# EAGLE design RGBdriver (EAGLE 7.2.0)
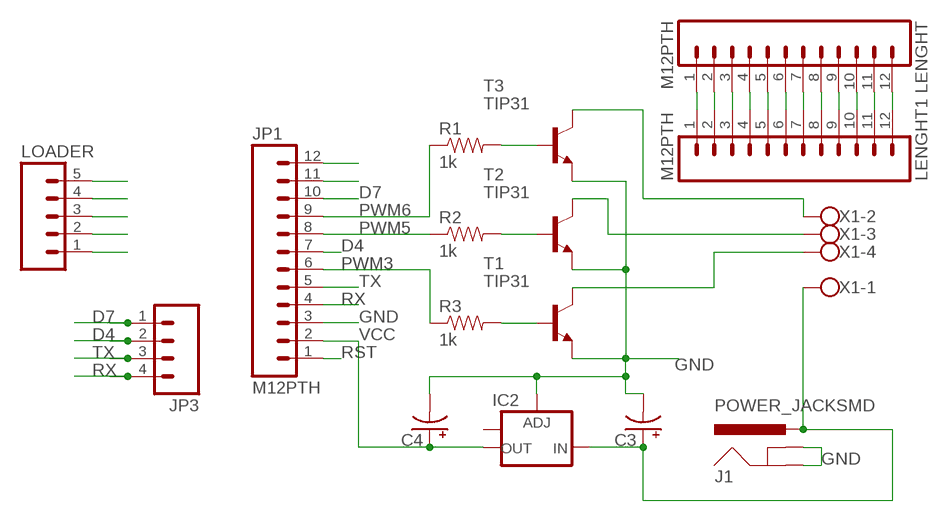
[diagram p0: schematic, sheet 1]

## Parts
C3  CAP_POLC  [PANASONIC_C]
C4  CAP_POLC  [PANASONIC_C]
IC2  V_REG_LM1117SOT223  [SOT223]
J1  POWER_JACKSMD  [POWER_JACK_SMD]
JP1  M12PTH  [1X12]
JP3  M04PTH  [1X04]
LENGHT  M12PTH  [1X12]
LENGHT1  M12PTH  [1X12]
LOADER  M05PTH  [1X05]
R1  1k  RESISTOR1206  [1206]
R2  1k  RESISTOR1206  [1206]
R3  1k  RESISTOR1206  [1206]
T1  TIP31  [TO220]
T2  TIP31  [TO220]
T3  TIP31  [TO220]
X1  W237-4  [W237-4]

## Nets
D4: JP1.7 JP3.2
D7: JP1.10 JP3.1
GND [power]: C3.- C4.- IC2.1(ADJ) J1.GND(GNDBREAK) J1.GNDBREAK(GND) JP1.3 JP1.11 JP1.12 LENGHT1.6 LENGHT1.12 LENGHT.6 LENGHT.12 LOADER.3 T1.3(E) T2.3(E) T3.3(E)
N$1: LENGHT1.1 LENGHT.1
N$2: R1.2 T3.1(B)
N$3: R3.2 T1.1(B)
N$4: T3.2(C) X1.2
N$5: T2.2(C) X1.3
N$6: LENGHT1.2 LENGHT.2
N$7: R2.2 T2.1(B)
N$8: T1.2(C) X1.4
N$9: C3.+ IC2.3(IN) J1.VIN0(PWR) X1.1
N$10: LENGHT1.3 LENGHT.3
N$11: LENGHT1.4 LENGHT.4
N$12: LENGHT1.5 LENGHT.5
N$14: LENGHT1.7 LENGHT.7
N$15: LENGHT1.8 LENGHT.8
N$16: LENGHT1.9 LENGHT.9
N$17: LENGHT1.10 LENGHT.10
N$18: LENGHT1.11 LENGHT.11
PWM3: JP1.6 R3.1
PWM5: JP1.8 R2.1
PWM6: JP1.9 R1.1
RST: JP1.1 LOADER.1
RX: JP1.4 JP3.4 LOADER.4
TX: JP1.5 JP3.3 LOADER.5
VCC [power]: C4.+ IC2.2(OUT) JP1.2 LOADER.2
Unconnected: IC2.4(OUT)

## Library data of the parts
C3 C4 = 01_SparkFun:CAP_POL: Capacitor Polarized These are standard SMD and PTH capacitors. Normally 10uF, 47uF, and 100uF in electrolytic and tantalum varieties. Always verify the external diameter of the through hole cap, it varies with capacity, voltage, and manufacturer. The EIA devices should be standard.
IC2 = 01_SparkFun:V_REG_LM1117: Voltage Regulator LM1117 Standard adjustable voltage regulator but in SMD form. Spark Fun Electronics SKU : COM-00595
J1 = 01_SparkFun:POWER_JACK: Power Jack This is the standard 5.5mm barrel jack for power. The PTH is the most common, proven, reliable, footprint. All others are experimental. The Slot footprint only works if the mill layer is transmitted to the PCB fab house so be warned. Spark Fun Electronics SKU : PRT-00119. Mating wall wart : TOL-00298 (and others)
JP1 LENGHT LENGHT1 = 01_SparkFun:M12: Header 12 Standard 12-pin 0.1" header. Use with straight break away headers (SKU : PRT-00116), right angle break away headers (PRT-00553), swiss pins (PRT-00743), machine pins (PRT-00117), and female headers (PRT-00115).
JP3 = 01_SparkFun:M04: Header 4 Standard 4-pin 0.1" header. Use with straight break away headers (SKU : PRT-00116), right angle break away headers (PRT-00553), swiss pins (PRT-00743), machine pins (PRT-00117), and female headers (PRT-00115). Molex polarized connector foot print use with SKU : PRT-08231 with associated crimp pins and housings.
LOADER = 01_SparkFun:M05: Header 5 Standard 5-pin 0.1" header. Use with straight break away headers (SKU : PRT-00116), right angle break away headers (PRT-00553), swiss pins (PRT-00743), machine pins (PRT-00117), and female headers (PRT-00115). Molex polarized connector foot print use with SKU : PRT-08230 with associated crimp pins and housings.
R1-R3 = 01_SparkFun:RESISTOR: Resistor Basic schematic elements and footprints for 0603, 1206, and PTH 1/10th watt (small) resistors.
T1-T3 = transistor:TIP31: NPN Transistor Medium Power Linear Switching Applications Source: http://onsemi.com
X1 = con-wago-500:W237-4: WAGO SCREW CLAMP; OC_FARNELL: unknown; OC_NEWARK: unknown

## Net classes
1 power: width 0.406 mm, clearance 1.016 mm
2 signal: width 0.203 mm, clearance 0.406 mm

## Board
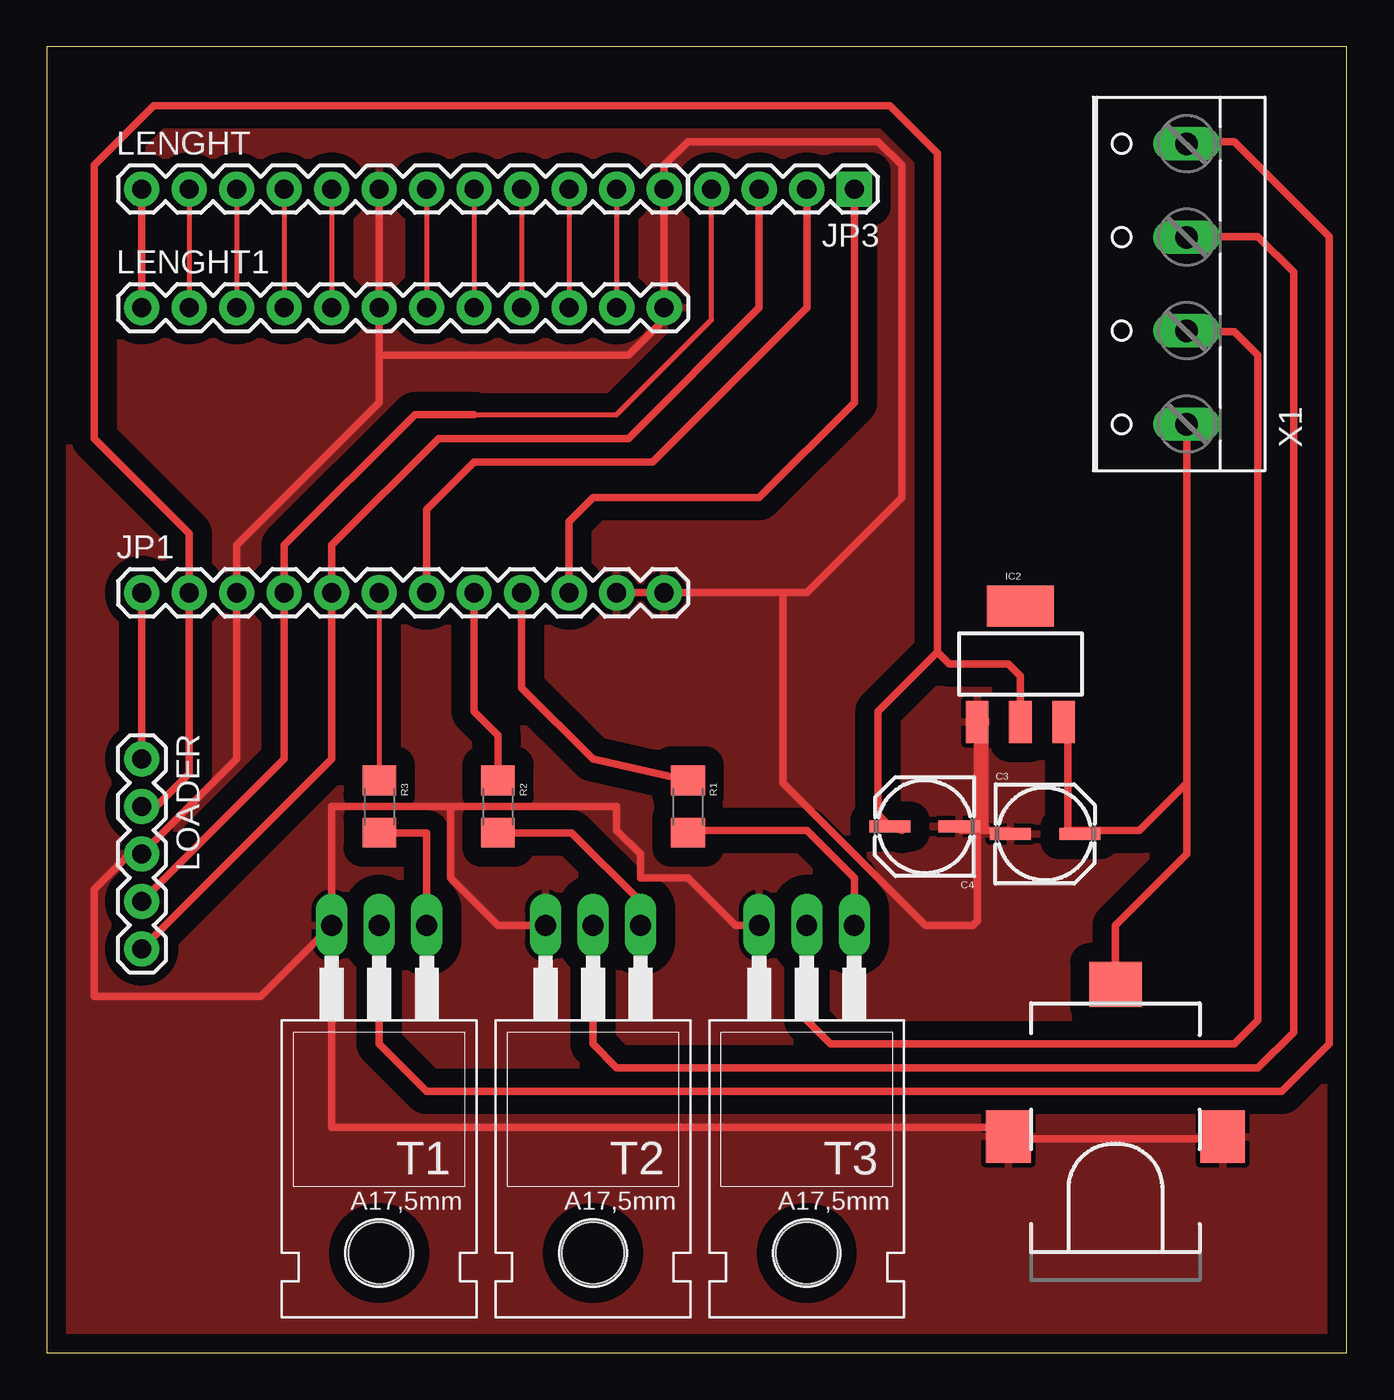
[diagram p1: board, top side]

Size 69.52 x 69.84 mm. Coordinates in mm from the lower left corner, seen from the top.
Outline: 0,0 69.52,0 69.52,69.84 0,69.84 0,0
Copper layers (1*16): Top 0.035mm / dielectric 1.5mm / Bottom 0.035mm
Design rules "default": minimum track width 10mil, minimum drill 24mil, track to track 8mil, track to pad 8mil, pad to pad 8mil, via to via 8mil, smd to smd 8mil, copper to edge 40mil, drill to drill 8mil, minimum pad ring 10mil, minimum via ring 8mil, stop-mask expansion 4mil, vias tented up to drill 0mil, thermal gap 10mil

### Footprints (pad centres in the part's own frame; a part is rotated, then mirrored left to right if it is on the bottom)
PANASONIC_C = smd 2.2 x 0.65: + 1.9,-0.2; - -1.8,-0.2
SOT223 = smd 1.219 x 2.235: 1 -2.311,-3.099; 2 0,-3.099; 3 2.311,-3.099 | smd 3.6 x 2.2: 4 0,3.099
POWER_JACK_SMD = smd 2.8 x 2.4: GND 2.667,-5.73; GNDBREAK 2.671,5.73 | smd 2.4 x 2.8: VIN0 10.81,0
1X12 = drill 1.016 pad 1.88: 1 0,0; 2 2.54,0; 3 5.08,0; 4 7.62,0; 5 10.16,0; 6 12.7,0; 7 15.24,0; 8 17.78,0; 9 20.32,0; 10 22.86,0; 11 25.4,0; 12 27.94,0
1X04 = drill 1.016 pad 1.88 square: 1 0,0 | drill 1.016 pad 1.88: 2 2.54,0; 3 5.08,0; 4 7.62,0
1X05 = drill 1.016 pad 1.88: 1 0,0; 2 2.54,0; 3 5.08,0; 4 7.62,0; 5 10.16,0
1206 = smd 1.6 x 1.8: 1 -1.4,0; 2 1.4,0
TO220 = drill 1.118 long: 1 -2.54,-6.35; 2 0,-6.35; 3 2.54,-6.35 | hole 3.302: 0,11.176
W237-4 = drill 1.194 long: 1 -7.5,-1.27; 2 -2.5,-1.27; 3 2.5,-1.27; 4 7.5,-1.27

### Placement (x,y rotation side)
C3  53.34,27.94 0 top
C4  46.99,27.94 180 top
IC2  52.07,36.83 0 top
J1  57.15,8.89 90 top
JP1  5.08,40.64 0 top
JP3  43.18,62.23 180 top
LENGHT  5.08,62.23 0 top
LENGHT1  5.08,55.88 0 top
LOADER  5.08,31.75 270 top
R1  34.29,29.21 270 top
R2  24.13,29.21 270 top
R3  17.78,29.21 270 top
T1  17.78,16.51 180 top
T2  29.21,16.51 180 top
T3  40.64,16.51 180 top
X1  59.69,57.15 90 top

### Tracks (layer width: path | path; a pad name or v marks a point on that pad's centre or on a via)
D4
  Top 0.406: JP3.2 40.64,55.88 32.38,47.62 22.86,47.62 20.32,45.08 JP1.7
D7
  Top 0.254: 27.94,41.27 JP1.10
  Top 0.406: 27.94,41.27 27.94,44.45 29.21,45.72 38.1,45.72 43.18,50.8 JP3.1
GND
  Top 0.406: J1.GND 62.23,12.07 62.23,11.43 51.44,11.43 J1.GNDBREAK 50.8,12.07 15.24,12.07 T1.3 | JP1.12 JP1.11 39.37,40.64 | 50.17,27.94 51.44,27.94 C3.- | 50.17,27.94 48.9,27.94 C4.- | 50.17,27.94 50.17,33.65 IC2.1 49.76,23.09 49.53,22.86 46.99,22.86 39.37,30.48 39.37,40.64 | 38.1,21.59 T3.3 36.83,22.86 34.29,25.4 31.75,25.4 31.75,26.67 30.48,27.94 30.48,29.21 21.59,29.21 | LENGHT.6 LENGHT1.6 17.78,53.34 | 17.78,53.34 17.78,50.8 10.16,43.18 JP1.3 10.16,31.75 LOADER.3 4.44,26.67 2.54,24.77 2.54,19.05 11.43,19.05 T1.3 | 17.78,53.34 31.12,53.34 33.02,55.24 LENGHT1.12 LENGHT.12 33.02,63.5 34.29,64.77 44.45,64.77 45.72,63.5 45.72,45.72 40.64,40.64 39.37,40.64 | T1.3 15.24,29.21 21.59,29.21 | T2.3 24.13,22.86 21.59,25.4 21.59,29.21
  pour Top: 0,69.85 69.85,69.85 69.85,68.58 69.85,0 0,0
N$1
  Top 0.406: LENGHT1.1 LENGHT.1
N$2
  Top 0.406: T3.1 43.18,25.4 40.64,27.94 34.42,27.94 R1.2
N$3
  Top 0.406: R3.2 20.32,27.81 T1.1
N$4
  Top 0.254: 60.96,54.61 X1.2
  Top 0.406: T3.2 40.64,17.78 41.91,16.51 63.5,16.51 64.77,17.78 64.77,53.34 63.5,54.61 61,54.61 | 61,54.61 X1.2 | 61,54.61 60.96,54.61
N$5
  Top 0.406: T2.2 29.21,16.51 30.48,15.24 64.77,15.24 66.67,17.14 66.67,57.78 64.77,59.69 61,59.69 X1.3
N$6
  Top 0.254: LENGHT.2 LENGHT1.2
N$7
  Top 0.406: R2.2 28.07,27.81 31.75,24.13 T2.1
N$8
  Top 0.254: 60.96,64.14 X1.4
  Top 0.406: T1.2 17.78,16.51 20.32,13.97 66.04,13.97 68.58,16.51 68.58,59.69 63.5,64.77 61.08,64.77 X1.4
N$9
  Top 0.254: 54.61,27.94 C3.+ 55.25,27.94 | 54.61,33.65 IC2.3 54.61,34.29 | 57.15,20.32 J1.VIN0 | 60.96,49.53 X1.1
  Top 0.406: 57.15,20.32 57.15,22.86 60.96,26.67 60.96,30.48 | 54.61,33.65 54.61,27.94 58.42,27.94 60.96,30.48 | X1.1 60.96,30.48
N$10
  Top 0.254: LENGHT.3 LENGHT1.3
N$11
  Top 0.254: LENGHT.4 LENGHT1.4
N$12
  Top 0.254: LENGHT.5 LENGHT1.5
N$14
  Top 0.254: LENGHT.7 LENGHT1.7
N$15
  Top 0.254: LENGHT.8 LENGHT1.8
N$16
  Top 0.254: LENGHT.9 LENGHT1.9
N$17
  Top 0.254: LENGHT.10 LENGHT1.10
N$18
  Top 0.254: LENGHT.11 LENGHT1.11
PWM3
  Top 0.254: JP1.6 R3.1
PWM5
  Top 0.406: JP1.8 22.86,34.29 24.13,33.02 R2.1
PWM6
  Top 0.406: JP1.9 25.4,35.56 29.21,31.75 R1.1
RST
  Top 0.406: LOADER.1 JP1.1
RX
  Top 0.254: JP1.4 12.7,40 | JP3.4 35.56,55.24 30.48,50.16 22.86,50.16 22.23,50.16
  Top 0.406: 12.7,40 12.7,31.75 LOADER.4 | JP1.4 12.7,43.18 19.69,50.16 22.86,50.16
TX
  Top 0.406: JP3.3 38.1,55.88 31.12,48.89 20.95,48.89 15.24,43.18 JP1.5 15.24,31.75 LOADER.5
VCC
  Top 0.406: 45.72,27.94 C4.+ 44.45,28.78 44.45,34.29 47.62,37.46 | LOADER.2 5.84,29.21 7.62,30.99 JP1.2 7.62,43.81 2.54,48.89 2.54,63.5 5.71,66.67 45.09,66.67 47.62,64.14 47.62,37.46 | IC2.2 52.07,36.2 51.44,36.83 48.26,36.83 47.62,37.46